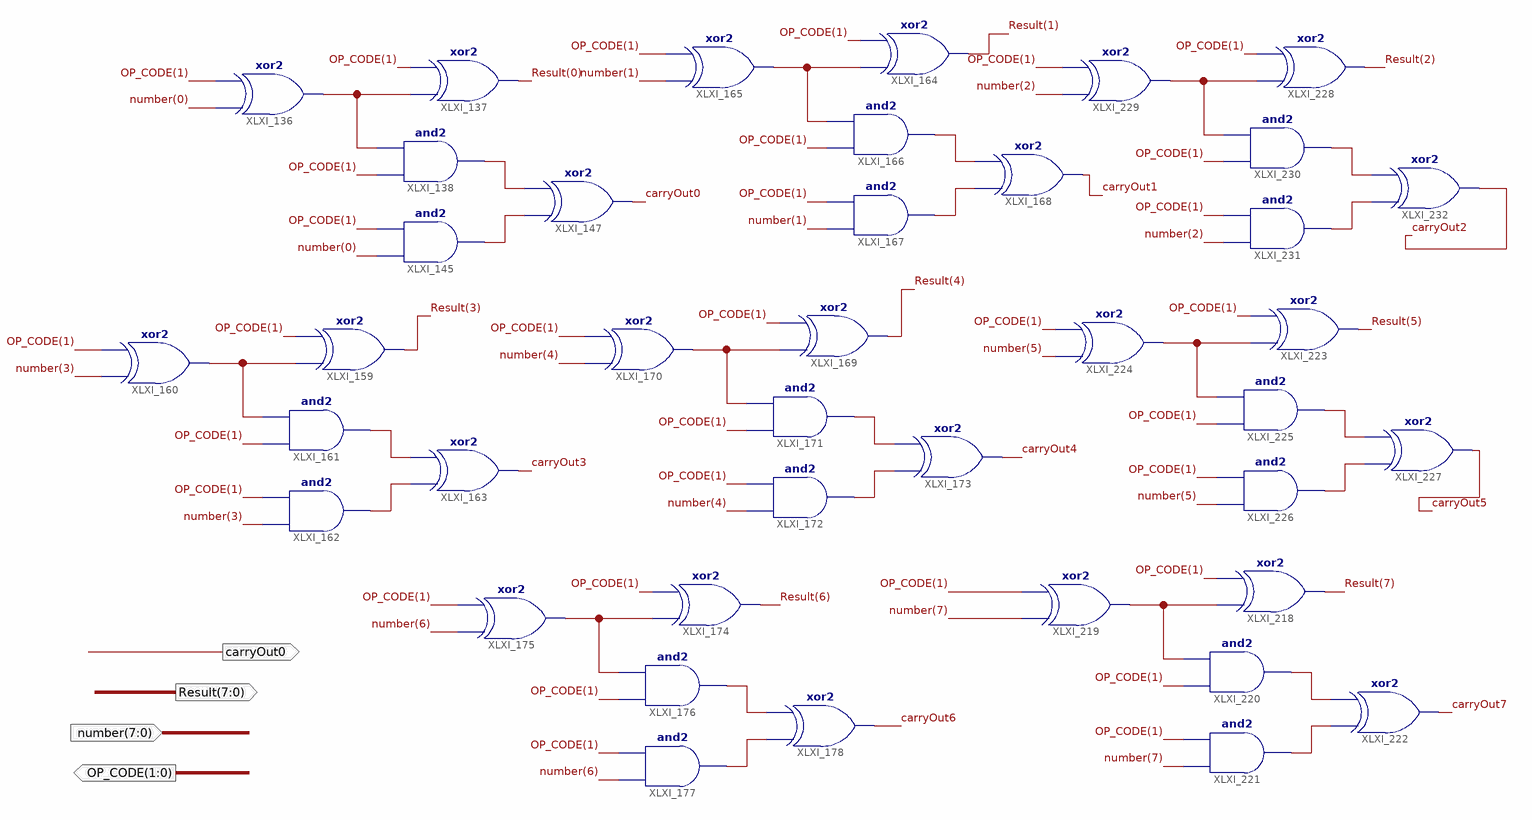
[diagram p0: schematic sheet 1]
// Xilinx ISE schematic trueAlu.sch (spartan3e) as structural Verilog: 40 symbols, 4 ports
module trueAlu (
  input  [7:0] number,
  output [1:0] OP_CODE,
  output [7:0] Result,
  output carryOut0
);

  wire carryOut1, carryOut2, carryOut3, carryOut4, carryOut5, carryOut6, carryOut7, XLXN_495, XLXN_496,
       XLXN_510, XLXN_514, XLXN_515, XLXN_519, XLXN_523, XLXN_524, XLXN_528, XLXN_532, XLXN_533, XLXN_537,
       XLXN_541, XLXN_542, XLXN_618, XLXN_622, XLXN_623, XLXN_627, XLXN_631, XLXN_632, XLXN_636, XLXN_640,
       XLXN_641;

  xor XLXI_136 (OP_CODE[1], number[0], OP_CODE[1]);
  xor XLXI_137 (Result[0], OP_CODE[1], OP_CODE[1]);
  and XLXI_138 (XLXN_495, OP_CODE[1], OP_CODE[1]);
  and XLXI_145 (XLXN_496, number[0], OP_CODE[1]);
  xor XLXI_147 (carryOut0, XLXN_496, XLXN_495);
  xor XLXI_159 (Result[3], XLXN_510, OP_CODE[1]);
  xor XLXI_160 (XLXN_510, number[3], OP_CODE[1]);
  and XLXI_161 (XLXN_514, OP_CODE[1], XLXN_510);
  and XLXI_162 (XLXN_515, number[3], OP_CODE[1]);
  xor XLXI_163 (carryOut3, XLXN_515, XLXN_514);
  xor XLXI_164 (Result[1], XLXN_519, OP_CODE[1]);
  xor XLXI_165 (XLXN_519, number[1], OP_CODE[1]);
  and XLXI_166 (XLXN_523, OP_CODE[1], XLXN_519);
  and XLXI_167 (XLXN_524, number[1], OP_CODE[1]);
  xor XLXI_168 (carryOut1, XLXN_524, XLXN_523);
  xor XLXI_218 (Result[7], XLXN_618, OP_CODE[1]);
  xor XLXI_219 (XLXN_618, number[7], OP_CODE[1]);
  and XLXI_220 (XLXN_622, OP_CODE[1], XLXN_618);
  and XLXI_221 (XLXN_623, number[7], OP_CODE[1]);
  xor XLXI_222 (carryOut7, XLXN_623, XLXN_622);
  xor XLXI_223 (Result[5], XLXN_627, OP_CODE[1]);
  xor XLXI_224 (XLXN_627, number[5], OP_CODE[1]);
  and XLXI_225 (XLXN_631, OP_CODE[1], XLXN_627);
  and XLXI_226 (XLXN_632, number[5], OP_CODE[1]);
  xor XLXI_227 (carryOut5, XLXN_632, XLXN_631);
  xor XLXI_228 (Result[2], XLXN_636, OP_CODE[1]);
  xor XLXI_229 (XLXN_636, number[2], OP_CODE[1]);
  and XLXI_230 (XLXN_640, OP_CODE[1], XLXN_636);
  and XLXI_231 (XLXN_641, number[2], OP_CODE[1]);
  xor XLXI_232 (carryOut2, XLXN_641, XLXN_640);
  xor XLXI_174 (Result[6], XLXN_537, OP_CODE[1]);
  xor XLXI_175 (XLXN_537, number[6], OP_CODE[1]);
  and XLXI_176 (XLXN_541, OP_CODE[1], XLXN_537);
  and XLXI_177 (XLXN_542, number[6], OP_CODE[1]);
  xor XLXI_178 (carryOut6, XLXN_542, XLXN_541);
  xor XLXI_169 (Result[4], XLXN_528, OP_CODE[1]);
  xor XLXI_170 (XLXN_528, number[4], OP_CODE[1]);
  and XLXI_171 (XLXN_532, OP_CODE[1], XLXN_528);
  and XLXI_172 (XLXN_533, number[4], OP_CODE[1]);
  xor XLXI_173 (carryOut4, XLXN_533, XLXN_532);
endmodule
